# EAGLE design rc13-mbed-main-board (EAGLE 6.5.0)
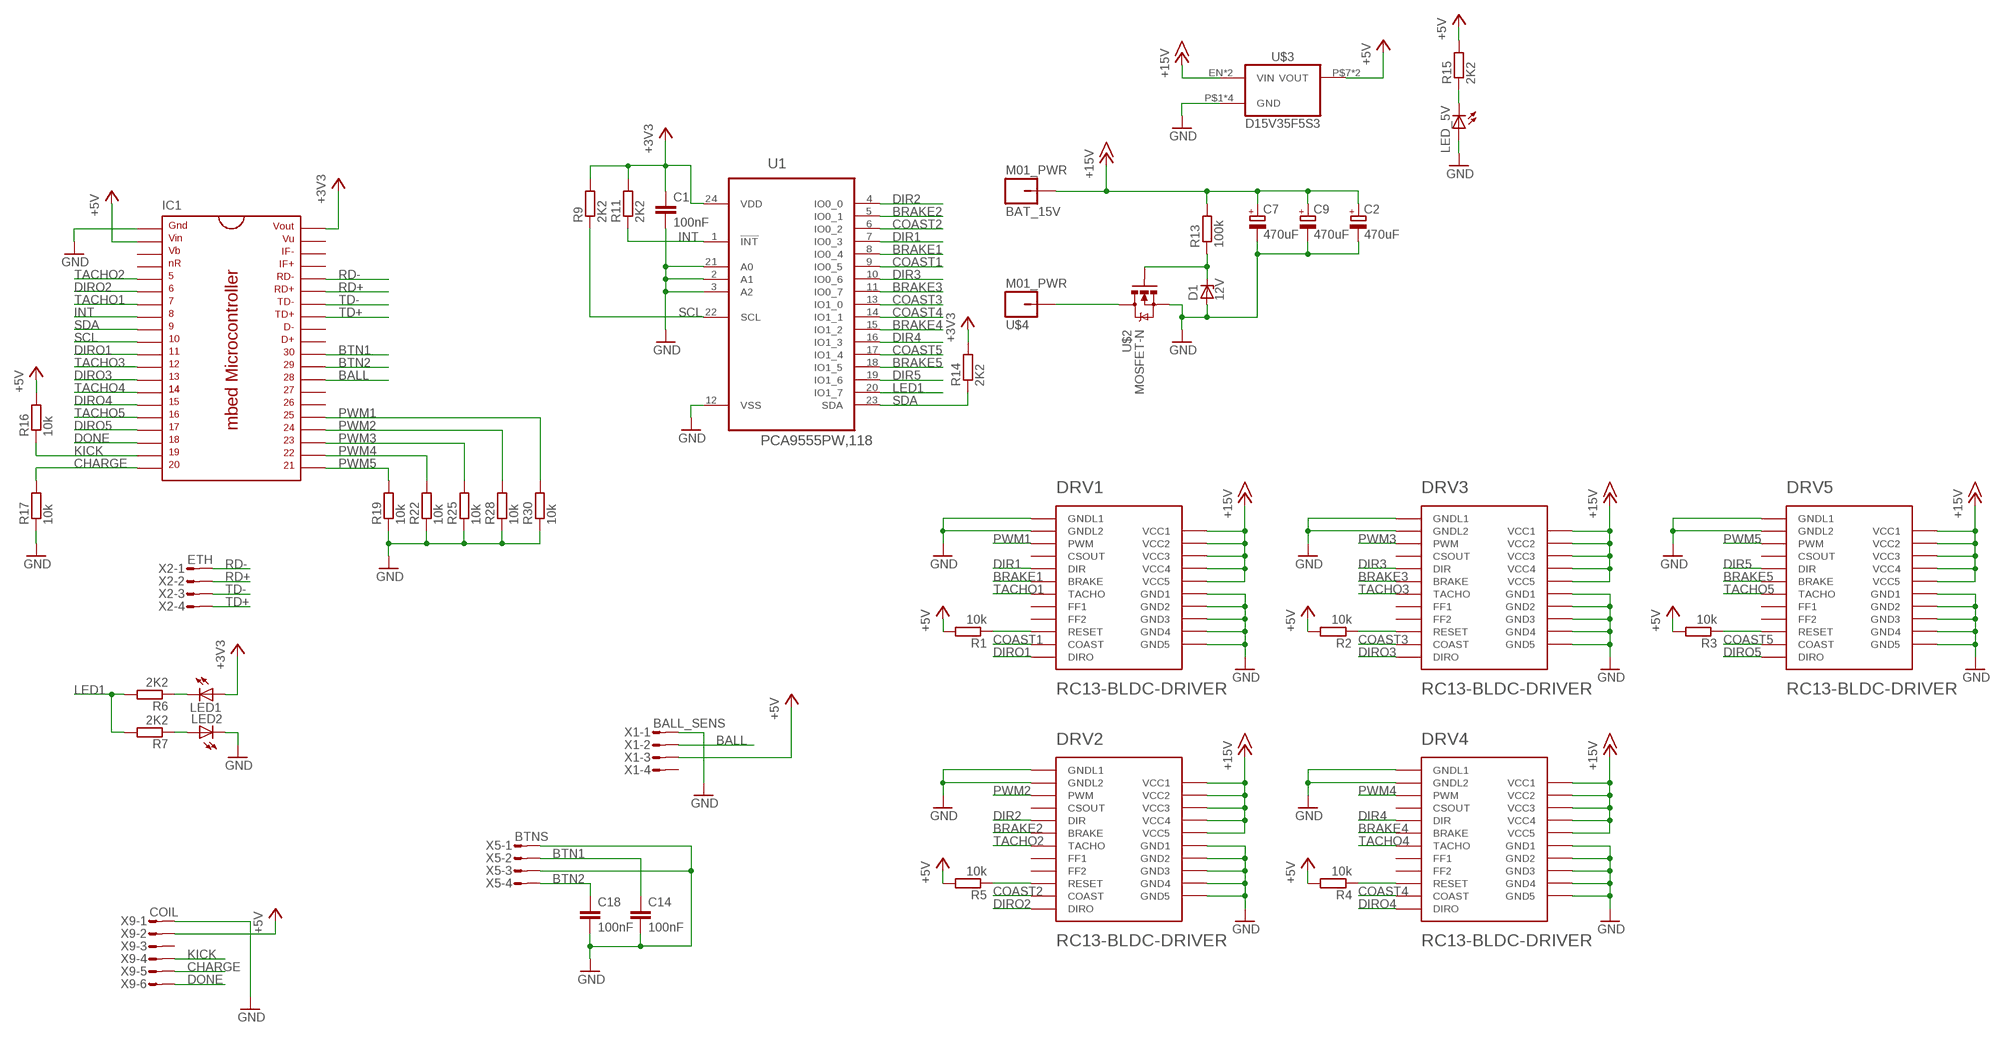
[diagram p0: schematic, sheet 1]

## Parts
BAT_15V  M01_PWR  [PWR_HOLE]
C1  100nF  C-EUC0603K  [C0603K]
C2  470uF  CPOL-EUE3.5-8  [E3,5-8]
C7  470uF  CPOL-EUE3.5-8  [E3,5-8]
C9  470uF  CPOL-EUE3.5-8  [E3,5-8]
C14  100nF  C-EUC0603K  [C0603K]
C18  100nF  C-EUC0603K  [C0603K]
D1  12V  ZENER-DIODESOD123  [SOD123]
DRV1  RC13-BLDC-DRIVER  [RC13-BLDC-DRIVER]
DRV2  RC13-BLDC-DRIVER  [RC13-BLDC-DRIVER]
DRV3  RC13-BLDC-DRIVER  [RC13-BLDC-DRIVER]
DRV4  RC13-BLDC-DRIVER  [RC13-BLDC-DRIVER]
DRV5  RC13-BLDC-DRIVER  [RC13-BLDC-DRIVER]
IC1  MBED_MICROCONTROLLER  [DIL40_0.9]
LED1  LEDCHIP-LED0603  [CHIP-LED0603]
LED2  LEDCHIP-LED0603  [CHIP-LED0603]
LED_5V  LEDCHIP-LED0603  [CHIP-LED0603]
R1  10k  R-EU_R0603  [R0603]
R2  10k  R-EU_R0603  [R0603]
R3  10k  R-EU_R0603  [R0603]
R4  10k  R-EU_R0603  [R0603]
R5  10k  R-EU_R0603  [R0603]
R6  2K2  R-EU_R0603  [R0603]
R7  2K2  R-EU_R0603  [R0603]
R9  2K2  R-EU_R0603  [R0603]
R11  2K2  R-EU_R0603  [R0603]
R13  100k  R-EU_R0603  [R0603]
R14  2K2  R-EU_R0603  [R0603]
R15  2K2  R-EU_R0603  [R0603]
R16  10k  R-EU_R0603  [R0603]
R17  10k  R-EU_R0603  [R0603]
R19  10k  R-EU_R0603  [R0603]
R22  10k  R-EU_R0603  [R0603]
R25  10k  R-EU_R0603  [R0603]
R28  10k  R-EU_R0603  [R0603]
R30  10k  R-EU_R0603  [R0603]
U1  PCA9555PW,118  [SOP65P640X110-24N]
U$2  MOSFET-N  MOSFET-N-SOT669  [TO127P600X120-5N]
U$3  D15V35F5S3  [D15V35F5S3]
U$4  M01_PWR  [PWR_HOLE]
X1  BALL_SENS  MICROMATCH-4  [MICROMATCH-4]
X2  ETH  MICROMATCH-4  [MICROMATCH-4]
X5  BTNS  MICROMATCH-4  [MICROMATCH-4]
X9  COIL  MICROMATCH-6  [MICROMATCH-6]

## Nets
+3V3: C1.1 IC1.40 LED1.A R9.2 R11.2 R14.2 U1.24(VDD)
+5V: IC1.2 R1.2 R2.2 R3.2 R4.2 R5.2 R15.2 R16.2 U$3.P$7(VOUT) U$3.P$8(VOUT) X1.3 X9.2
+15V: BAT_15V.P$1 C2.+ C7.+ C9.+ DRV1.PWR1(VCC1) DRV1.PWR2(VCC2) DRV1.PWR3(VCC3) DRV1.PWR4(VCC4) DRV1.PWR5(VCC5) DRV2.PWR1(VCC1) DRV2.PWR2(VCC2) DRV2.PWR3(VCC3) DRV2.PWR4(VCC4) DRV2.PWR5(VCC5) DRV3.PWR1(VCC1) DRV3.PWR2(VCC2) DRV3.PWR3(VCC3) DRV3.PWR4(VCC4) DRV3.PWR5(VCC5) DRV4.PWR1(VCC1) DRV4.PWR2(VCC2) DRV4.PWR3(VCC3) DRV4.PWR4(VCC4) DRV4.PWR5(VCC5) DRV5.PWR1(VCC1) DRV5.PWR2(VCC2) DRV5.PWR3(VCC3) DRV5.PWR4(VCC4) DRV5.PWR5(VCC5) R13.2 U$3.EN(VIN) U$3.P$5(VIN)
BALL: IC1.28 X1.2
BAT_GND: U$2.5(D) U$4.P$1
BRAKE1: DRV1.LOGIC6(BRAKE) U1.8(IO0_4)
BRAKE2: DRV2.LOGIC6(BRAKE) U1.5(IO0_1)
BRAKE3: DRV3.LOGIC6(BRAKE) U1.11(IO0_7)
BRAKE4: DRV4.LOGIC6(BRAKE) U1.15(IO1_2)
BRAKE5: DRV5.LOGIC6(BRAKE) U1.18(IO1_5)
BTN1: C14.1 IC1.30 X5.2
BTN2: C18.1 IC1.29 X5.4
CHARGE: IC1.20 R17.2 X9.5
COAST1: DRV1.LOGIC11(COAST) U1.9(IO0_5)
COAST2: DRV2.LOGIC11(COAST) U1.6(IO0_2)
COAST3: DRV3.LOGIC11(COAST) U1.13(IO1_0)
COAST4: DRV4.LOGIC11(COAST) U1.14(IO1_1)
COAST5: DRV5.LOGIC11(COAST) U1.17(IO1_4)
DIR1: DRV1.LOGIC5(DIR) U1.7(IO0_3)
DIR2: DRV2.LOGIC5(DIR) U1.4(IO0_0)
DIR3: DRV3.LOGIC5(DIR) U1.10(IO0_6)
DIR4: DRV4.LOGIC5(DIR) U1.16(IO1_3)
DIR5: DRV5.LOGIC5(DIR) U1.19(IO1_6)
DIRO1: DRV1.LOGIC12(DIRO) IC1.11
DIRO2: DRV2.LOGIC12(DIRO) IC1.6
DIRO3: DRV3.LOGIC12(DIRO) IC1.13
DIRO4: DRV4.LOGIC12(DIRO) IC1.15
DIRO5: DRV5.LOGIC12(DIRO) IC1.17
DONE: IC1.18 X9.6
GND: C1.2 C2.- C7.- C9.- C14.2 C18.2 D1.A DRV1.LOGIC1(GNDL1) DRV1.LOGIC2(GNDL2) DRV1.PWR6(GND1) DRV1.PWR7(GND2) DRV1.PWR8(GND3) DRV1.PWR9(GND4) DRV1.PWR10(GND5) DRV2.LOGIC1(GNDL1) DRV2.LOGIC2(GNDL2) DRV2.PWR6(GND1) DRV2.PWR7(GND2) DRV2.PWR8(GND3) DRV2.PWR9(GND4) DRV2.PWR10(GND5) DRV3.LOGIC1(GNDL1) DRV3.LOGIC2(GNDL2) DRV3.PWR6(GND1) DRV3.PWR7(GND2) DRV3.PWR8(GND3) DRV3.PWR9(GND4) DRV3.PWR10(GND5) DRV4.LOGIC1(GNDL1) DRV4.LOGIC2(GNDL2) DRV4.PWR6(GND1) DRV4.PWR7(GND2) DRV4.PWR8(GND3) DRV4.PWR9(GND4) DRV4.PWR10(GND5) DRV5.LOGIC1(GNDL1) DRV5.LOGIC2(GNDL2) DRV5.PWR6(GND1) DRV5.PWR7(GND2) DRV5.PWR8(GND3) DRV5.PWR9(GND4) DRV5.PWR10(GND5) IC1.1 LED2.C LED_5V.A R17.1 R19.1 R22.1 R25.1 R28.1 R30.1 U1.2(A1) U1.3(A2) U1.12(VSS) U1.21(A0) U$2.1(S) U$2.2(S) U$2.3(S) U$3.P$1(GND) U$3.P$2(GND) U$3.P$3(GND) U$3.P$4(GND) X1.1 X5.1 X5.3 X9.1
INT: IC1.8 R11.1 U1.1(!INT)
KICK: IC1.19 R16.1 X9.4
LED1: R6.2 R7.2 U1.20(IO1_7)
N$2: DRV1.LOGIC10(RESET) R1.1
N$3: DRV2.LOGIC10(RESET) R5.1
N$4: DRV4.LOGIC10(RESET) R4.1
N$5: DRV5.LOGIC10(RESET) R3.1
N$6: DRV3.LOGIC10(RESET) R2.1
N$7: LED1.C R6.1
N$8: LED2.A R7.1
N$9: LED_5V.C R15.1
N$20: D1.C R13.1 U$2.4(G)
PWM1: DRV1.LOGIC3(PWM) IC1.25 R30.2
PWM2: DRV2.LOGIC3(PWM) IC1.24 R28.2
PWM3: DRV3.LOGIC3(PWM) IC1.23 R25.2
PWM4: DRV4.LOGIC3(PWM) IC1.22 R22.2
PWM5: DRV5.LOGIC3(PWM) IC1.21 R19.2
RD+: IC1.35 X2.2
RD-: IC1.36 X2.1
SCL: IC1.10 R9.1 U1.22(SCL)
SDA: IC1.9 R14.1 U1.23(SDA)
TACHO1: DRV1.LOGIC7(TACHO) IC1.7
TACHO2: DRV2.LOGIC7(TACHO) IC1.5
TACHO3: DRV3.LOGIC7(TACHO) IC1.12
TACHO4: DRV4.LOGIC7(TACHO) IC1.14
TACHO5: DRV5.LOGIC7(TACHO) IC1.16
TD+: IC1.33 X2.4
TD-: IC1.34 X2.3
Unconnected: DRV1.LOGIC4(CSOUT) DRV1.LOGIC8(FF1) DRV1.LOGIC9(FF2) DRV2.LOGIC4(CSOUT) DRV2.LOGIC8(FF1) DRV2.LOGIC9(FF2) DRV3.LOGIC4(CSOUT) DRV3.LOGIC8(FF1) DRV3.LOGIC9(FF2) DRV4.LOGIC4(CSOUT) DRV4.LOGIC8(FF1) DRV4.LOGIC9(FF2) DRV5.LOGIC4(CSOUT) DRV5.LOGIC8(FF1) DRV5.LOGIC9(FF2) IC1.3 IC1.4 IC1.26 IC1.27 IC1.31 IC1.32 IC1.37 IC1.38 IC1.39 X1.4 X9.3

## Library data of the parts
BAT_15V U$4 = tellis2:M01_PWR
C1 C14 C18 = rcl:C-EU: CAPACITOR, European symbol
C2 C7 C9 = rcl:CPOL-EU: POLARIZED CAPACITOR, European symbol
D1 = diode:ZENER-DIODE: Z-Diode
DRV1-DRV5 = rc13-bldc-driver:RC13-BLDC-DRIVER
IC1 = mbed-microcontroller:MBED_MICROCONTROLLER: mbed Microcontroller, DIP40, 0.9"
LED1 LED2 LED_5V = led:LED: LED OSRAM: - CHIPLED LG R971, LG N971, LY N971, LG Q971, LY Q971, LO R971, LY R971 LH N974, LH R974 LS Q976, LO Q976, LY Q976 LO Q996 - Hyper CHIPLED LW Q18S LB Q993, LB Q99A, LB R99A - SideLED LS A670, LO A670, LY A670, LG A670, LP A670 LB A673, LV A673, LT A673, LW A673 LH A674 LY A675 LS A676, LA A676, LO A676, LY A676, LW A676 LS A679, LY A679, LG A679 - Hyper Micro SIDELED® LS Y876, LA Y876, LO Y876, LY Y876 LT Y87S - SmartLED LW L88C, LW L88S LB L89C, LB L89S, LG L890 LS L89K, LO L89K, LY L89K LS L896, LA L896, LO L896, LY L896 - TOPLED LS T670, LO T670, LY T670, LG T670, LP T670 LSG T670, LSP T670, LSY T670, LOP T670, LYG T670 LG T671, LOG T671, LSG T671 LB T673, LV T673, LT T673, LW T673 LH T674 LS T676, LA T676, LO T676, LY T676, LB T676, LH T676, LSB T676, LW T676 LB T67C, LV T67C, LT T67C, LS T67K, LO T67K, LY T67K, LW E67C LS E67B, LA E67B, LO E67B, LY E67B, LB E67C, LV E67C, LT E67C LW T67C LS T679, LY T679, LG T679 LS T770, LO T770, LY T770, LG T770, LP T770 LB T773, LV T773, LT T773, LW T773 LH T774 LS E675, LA E675, LY E675, LS T675 LS T776, LA T776, LO T776, LY T776, LB T776 LHGB T686 LT T68C, LB T68C - Hyper Mini TOPLED® LB M676 - Mini TOPLED Santana® LG M470 LS M47K, LO M47K, LY M47K Source: http://www.osram.convergy.de LUXEON: - LUMILED® LXK2-PW12-R00, LXK2-PW12-S00, LXK2-PW14-U00, LXK2-PW14-V00 LXK2-PM12-R00, LXK2-PM12-S00, LXK2-PM14-U00 LXK2-PE12-Q00, LXK2-PE12-R00, LXK2-PE12-S00, LXK2-PE14-T00, LXK2-PE14-U00 LXK2-PB12-K00, LXK2-PB12-L00, LXK2-PB12-M00, LXK2-PB14-N00, LXK2-PB14-P00, LXK2-PB14-Q00 LXK2-PR12-L00, LXK2-PR12-M00, LXK2-PR14-Q00, LXK2-PR14-R00 LXK2-PD12-Q00, LXK2-PD12-R00, LXK2-PD12-S00 LXK2-PH12-R00, LXK2-PH12-S00 LXK2-PL12-P00, LXK2-PL12-Q00, LXK2-PL12-R00 Source: www.luxeon.com KINGBRIGHT: KA-3528ASYC Source: www.kingbright.com
R1-R7 R9 R11 R13-R17 R19 R22 R25 R28 R30 = rcl:R-EU_: RESISTOR, European symbol
U1 = PCA9555:PCA9555PW,118: IC, I/O EXPANDER, 16BIT, 24TSSOP; MPN: PCA9555PW,118; OC_FARNELL: 2101299; OC_NEWARK: 70R6680; PACKAGE: 24TSSOP; SUPPLIER: NXP
U$2 = nxp_sot669:MOSFET-N-SOT669
U$3 = D15V35F5S3:D15V35F5S3
X1 X2 X5 = con-amp-micromatch:MICROMATCH-4: MicroMaTch 4 7-215464-4 / 0-215464-4 Drawing Number C-215464 DDEController.pdf; MPN: 7-215464-4; OC_FARNELL: 3784629; OC_NEWARK: 19R8124
X9 = con-amp-micromatch:MICROMATCH-6: MicroMaTch 6 7-215464-6 / 0-215464-6 Drawing Number C-215464 DDEController.pdf; MPN: 7-215464-6; OC_FARNELL: 3784630; OC_NEWARK: 19R8125

## Board
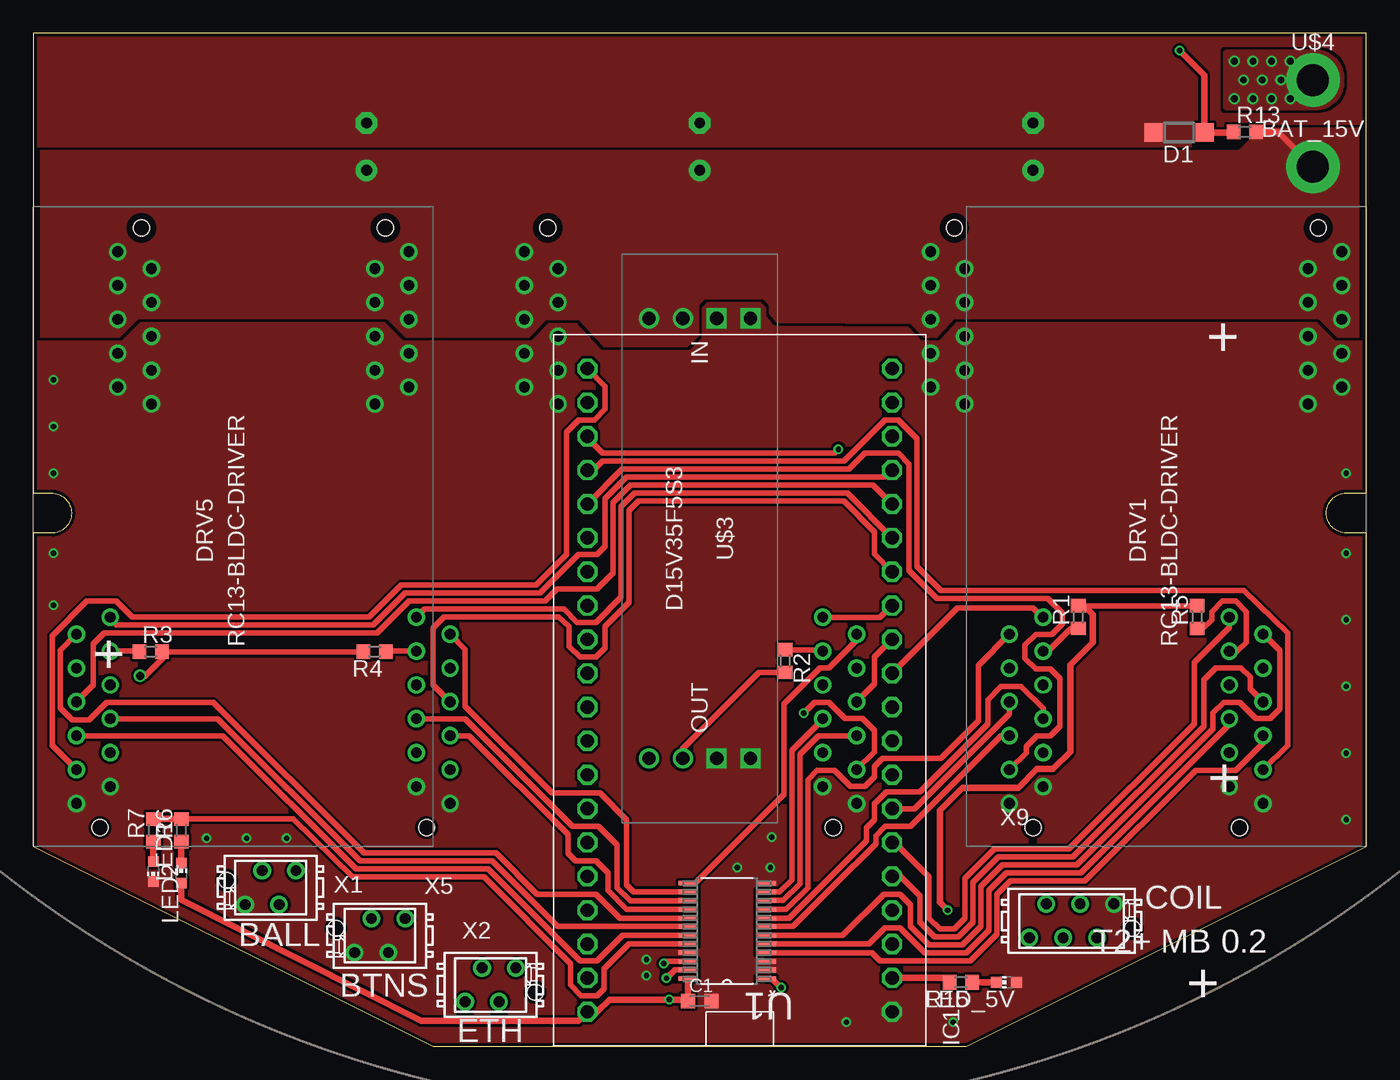
[diagram p1: board, top side]
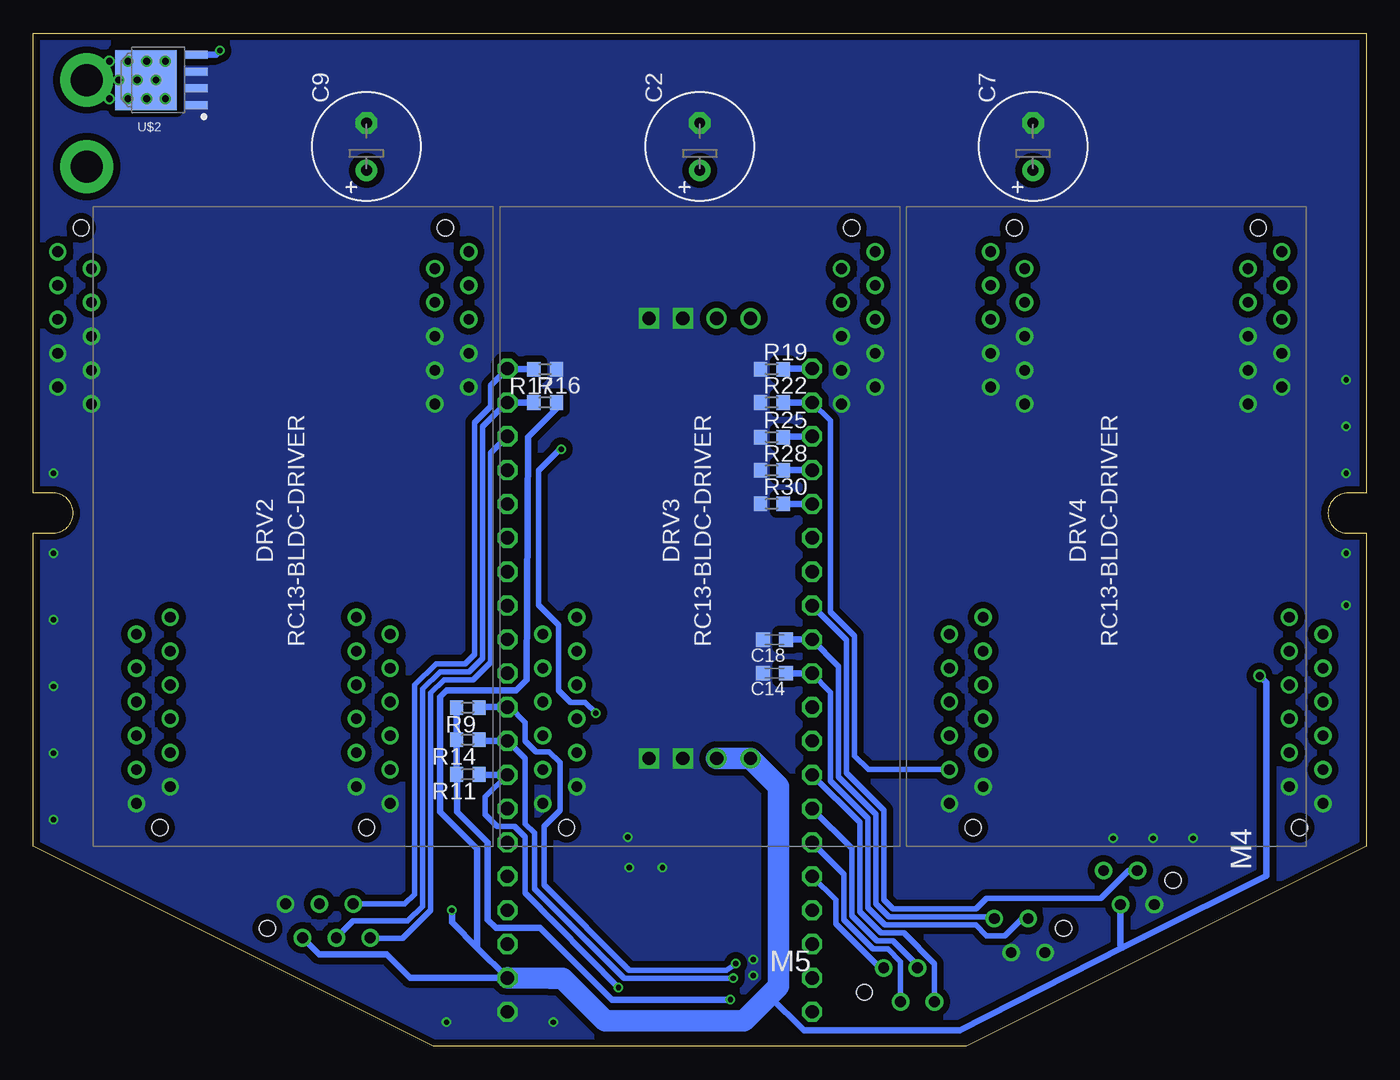
[diagram p2: board, bottom side, seen from below]

Size 100 x 76 mm. Coordinates in mm from the lower left corner, seen from the top.
Outline: 0,15 30,0 70,0 100,15 100,38.5 98.5,38.5 arc-180 98.5,41.5 100,41.5 100,76 0,76 0,41.5 1.5,41.5 arc-169 1.5,38.5 0,38.5 0,15
Copper layers (1*16): Top 0.035mm / dielectric 1.5mm / Bottom 0.035mm
Design rules "Fusion_eagle_rule_v1.1 *": minimum track width 6mil, minimum drill 12mil, track to track 0.2mm, track to pad 0.2mm, pad to pad 0.2mm, via to via 0.2mm, smd to smd 0mil, copper to edge 10mil, drill to drill 10mil, minimum pad ring 10mil, minimum via ring 6mil, stop-mask expansion 2mil, vias tented up to drill 100mil, thermal gap 10mil
Holes 1.2 mm at 82.45,8.85 37.65,4.05 22.7,8.85 14.5,12.45

### Footprints (pad centres in the part's own frame; a part is rotated, then mirrored left to right if it is on the bottom)
PWR_HOLE = drill 2.4 pad 4: P$1 0,0
C0603K = smd 1.05 x 1.08: 1 -0.875,0; 2 0.875,0
E3,5-8 = drill 0.813 pad 1.6: + -1.778,0 | drill 0.813 pad 1.6 octagon: - 1.778,0
SOD123 = smd 1.4 x 1.4: A 1.9,0; C -1.9,0
RC13-BLDC-DRIVER = drill 0.8 pad 1.3: LOGIC1 3.215,26.77; LOGIC2 4.485,24.23; LOGIC3 5.755,26.77; LOGIC4 7.025,24.23; LOGIC5 8.295,26.77; LOGIC6 9.565,24.23; LOGIC7 10.835,26.77; LOGIC8 12.105,24.23; LOGIC9 13.375,26.77; LOGIC10 14.645,24.23; LOGIC11 15.915,26.77; LOGIC12 17.185,24.23; PWR1 44.615,1.83; PWR2 43.345,4.37; PWR3 42.075,1.83; PWR4 40.805,4.37; PWR5 39.535,1.83; PWR6 38.265,4.37; PWR7 36.995,1.83; PWR8 35.725,4.37; PWR9 34.455,1.83; PWR10 33.185,4.37 | hole 1.2: 1.4,25; 46.4,3.6
DIL40_0.9 = drill 1 pad 1.397 octagon: 1 -22.86,-11.43; 2 -20.32,-11.43; 3 -17.78,-11.43; 4 -15.24,-11.43; 5 -12.7,-11.43; 6 -10.16,-11.43; 7 -7.62,-11.43; 8 -5.08,-11.43; 9 -2.54,-11.43; 10 0,-11.43; 11 2.54,-11.43; 12 5.08,-11.43; 13 7.62,-11.43; 14 10.16,-11.43; 15 12.7,-11.43; 16 15.24,-11.43; 17 17.78,-11.43; 18 20.32,-11.43; 19 22.86,-11.43; 20 25.4,-11.43; 21 25.4,11.43; 22 22.86,11.43; 23 20.32,11.43; 24 17.78,11.43; 25 15.24,11.43; 26 12.7,11.43; 27 10.16,11.43; 28 7.62,11.43; 29 5.08,11.43; 30 2.54,11.43; 31 0,11.43; 32 -2.54,11.43; 33 -5.08,11.43; 34 -7.62,11.43; 35 -10.16,11.43; 36 -12.7,11.43; 37 -15.24,11.43; 38 -17.78,11.43; 39 -20.32,11.43; 40 -22.86,11.43
CHIP-LED0603 = smd 0.8 x 0.8: A 0,-0.75; C 0,0.75
R0603 = smd 1 x 1.1: 1 -0.85,0; 2 0.85,0
SOP65P640X110-24N = smd 1.473 x 0.356: 1 -2.921,3.581; 2 -2.921,2.921; 3 -2.921,2.286; 4 -2.921,1.626; 5 -2.921,0.965; 6 -2.921,0.33; 7 -2.921,-0.33; 8 -2.921,-0.965; 9 -2.921,-1.626; 10 -2.921,-2.286; 11 -2.921,-2.921; 12 -2.921,-3.581; 13 2.921,-3.581; 14 2.921,-2.921; 15 2.921,-2.286; 16 2.921,-1.626; 17 2.921,-0.965; 18 2.921,-0.33; 19 2.921,0.33; 20 2.921,0.965; 21 2.921,1.626; 22 2.921,2.286; 23 2.921,2.921; 24 2.921,3.581
TO127P600X120-5N = smd 1.65 x 0.6: 1 -2.65,1.905; 2 -2.65,0.635; 3 -2.65,-0.635; 4 -2.65,-1.905 | smd 4.6 x 4.5: 5 1.15,0
D15V35F5S3 = drill 1: EN -16.51,-3.81; P$5 -16.51,-1.27; P$7 16.51,-1.27; P$8 16.51,-3.81 | drill 1 square: P$1 -16.51,3.81; P$2 -16.51,1.27; P$3 16.51,3.81; P$4 16.51,1.27
MICROMATCH-4 = drill 0.813: 1 1.905,1.27; 2 0.635,-1.27; 3 -0.635,1.27; 4 -1.905,-1.27
MICROMATCH-6 = drill 0.813: 1 3.175,1.27; 2 1.905,-1.27; 3 0.635,1.27; 4 -0.635,-1.27; 5 -1.905,1.27; 6 -3.175,-1.27

### Placement (x,y rotation side)
BAT_15V  96,66 0 top
C1  50,3.4 0 top
C2  50,67.5 90 bottom
C7  25,67.5 90 bottom
C9  75,67.5 90 bottom
C14  44.4,28 180 bottom
C18  44.4,30.5 180 bottom
D1  85.95,68.56 180 top
DRV1  100,15 90 top
DRV2  65.5,15 90 bottom
DRV3  35,15 90 bottom
DRV4  4.5,15 90 bottom
DRV5  30,15 90 top
IC1  53,25.44 90 top
LED1  11.1,13 0 top
LED2  9,13.1 180 top
LED_5V  73,4.8 90 top
R1  78.4,32.2 90 top
R2  56.4,28.9 270 top
R3  8.8,29.6 0 top
R4  25.6,29.6 180 top
R5  87.3,32.2 90 top
R6  11.1,16.2 90 top
R7  9,16.2 90 top
R9  67.4,25.4 180 bottom
R11  67.4,20.4 180 bottom
R13  90.89,68.59 0 top
R14  67.4,23 180 bottom
R15  69.6,4.8 180 top
R16  61.6,48.3 0 bottom
R17  61.6,50.8 180 bottom
R19  44.6,50.8 0 bottom
R22  44.6,48.3 0 bottom
R25  44.6,45.7 0 bottom
R28  44.6,43.2 0 bottom
R30  44.6,40.7 0 bottom
U1  52.05,8.65 180 top
U$2  90.4,72.5 180 bottom
U$3  50,38.1 270 top
U$4  96,72.5 0 top
X1  17.8,11.9 180 top
X2  34.3,4.6 0 top
X5  26,8.3 180 top
X9  77.9,9.4 0 top

### Tracks (layer width: path | path; a pad name or v marks a point on that pad's centre or on a via)
+3V3  (via drill 0.4)
  Top 0.4: C1.1 | 11.1,11.7 LED1.A
  Top 0.5: C1.1 U1.24 | C1.1 49.02,3.5 v47.7,3.5 43.22,3.5 42.3,2.58 IC1.40 41.54,2.54 40.9,1.9 29.1,1.9 11.1,11 11.1,11.7
  Bottom 0.5: R9.2 R14.2 R11.2 68.2,20.35 68.2,17.6 65.9,15.3 65.9,9.5 65.3,8.9 62,8.9 56.6,3.5 v47.7,3.5
+5V  (via drill 0.4, 0.6)
  Top 0.4: R1.2 R5.2 | R2.2 54.45,28.05 48.7,22.3 48.7,21.62 U$3.P$7
  Top 0.406: R3.2 R4.2
  Top 0.5: R15.2 68.23,5.12 IC1.2 | 24.7,29.45 R4.2 | v8,27.8 8.4,27.8 9.7,29.1 9.7,29.55 R3.2 | R1.2 78.85,33.05 79.5,32.4 79.5,30.3 77.8,28.6 77.8,22.1 76.5,20.8 75.3,20.8 73.9,19.4 69.7,19.4 68,17.7 68,10.8 v68.6,10.2
  Bottom 0.5: 61.2,5.2 IC1.2 | R16.2 60.75,47.85 62.9,45.7 63,27.5 63.8,26.7 69,26.7 69.5,26.2 69.5,17.6 66.7,14.8 66.7,7.4 | IC1.2 66.7,7.4 | 18.25,7.41 16.7,8.2 7.5,12.8 7.5,27.3 v8,27.8 | 18.25,7.41 30.5,1.2 42.2,1.2 44.8,3.8 | v68.6,10.2 68.6,9.3 66.7,7.4 | X9.2 78.58,6.9 73.5,6.9 71.72,5.12 IC1.2 | X1.3 18.43,7.59 18.25,7.41
  Bottom 1.6: U$3.P$7 U$3.P$8 44.09,19.49 44.09,4.51 44.8,3.8 46.7,1.9 57.1,1.9 60.3,5.1 61.18,5.1 IC1.2
+15V
  Top 0.5: R13.2 93.41,68.59 BAT_15V.P$1
  pour Top (isolate 0.5, no thermals): 0,53.4 6.4,53.4 7.8,54.8 26.6,54.8 28,53.4 37.1,53.4 38.4,54.7 41,54.7 42.9,52.7 49,52.7 49.7,53.4 49.7,55.7 50.3,56.3 54.8,56.3 55.4,55.7 55.4,55.1 55.9,54.5 65.9,54.4 66.9,53.4 67.7,53.4 69,54.8 96.5,54.8 97.9,53.4 100,53.4 100,68.7 92.2,68.7 90.5,67 0,67
BALL
  Bottom 0.4: IC1.28 39,30.49 39,20.5 36.2,17.7 36.2,11 35.5,10.3 29.3,10.3 28.5,11.1 19.9,11.1 17.8,13.2 17.2,13.2 X1.2
BAT_GND  (via drill 0.5)
  Bottom 0.4: v92.2,72.5 U$2.5
  other vias: 90.1,73.9 90.8,72.5 90.1,71.1 91.5,73.9 91.5,71.1 92.9,73.9 93.6,72.5 92.9,71.1 94.3,73.9 94.3,71.1
  pour Top (isolate 0.5, no thermals): 89.5,74.55 89.5,70.45 96.15,70.45 arc90 98.15,72.45 98.15,72.55 arc90 96.15,74.55
BRAKE1
  Top 0.4: DRV1.LOGIC6 75.77,25.33 74.1,27 72.6,27 71.6,26 71.6,24.2 | U1.8 54.99,9.6 56.7,9.6 59.4,12.3
  Top 0.406: 59.4,12.3 62.5,15.4 62.5,16.4 63.1,17 63.1,18.2 64,19.1 66.5,19.1 71.6,24.2
BRAKE2
  Top 0.4: U1.5 62.69,7.68 63.9,8.9 65,8.9 66.9,7 70,7 71.7,8.7 71.7,11.7 73,13 78.6,13 89.7,24.1 89.7,24.54 DRV2.LOGIC6
BRAKE3
  Top 0.4: U1.11 55.97,11.57 56.9,12.5 56.9,22.2 59.23,24.53 DRV3.LOGIC6
BRAKE4
  Top 0.4: 49.09,10.9 U1.15
  Top 0.406: 49.09,10.9 44.8,10.9 43.8,11.9 43.8,15.1 42.4,16.5 40.47,16.5 32.4,24.57 DRV4.LOGIC6
BRAKE5
  Top 0.4: 39.32,8.98 34.4,13.9 24.5,13.9 13.84,24.57 DRV5.LOGIC6
  Top 0.406: U1.18 39.32,8.98
BTN1
  Bottom 0.4: IC1.30 40.2,26.54 40.2,19.9 37.4,17.1 37.4,10.4 36.1,9.1 29.3,9.1 28.5,8.3 27.1,8.3 25.83,9.57 X5.2
  Bottom 0.5: IC1.30 43.1,27.98 C14.1
BTN2
  Bottom 0.4: IC1.29 39.6,28.48 39.6,20.2 36.8,17.4 36.8,10.7 35.8,9.7 28.04,9.7 X5.4
  Bottom 0.5: IC1.29 43.41,30.52 C18.1
CHARGE
  Bottom 0.4: IC1.20 65.7,49.57 65.7,48 66.9,46.8 66.9,29.4 67.6,28.7 69.8,28.7 71.4,27.1 71.4,11.4 72.13,10.67 X9.5
  Bottom 0.5: IC1.20 64.06,50.8 R17.2
COAST1
  Top 0.4: U1.9 56.48,10.28 58.1,11.9 58.1,20 58.8,20.7 60.1,20.7 61.3,19.5 62.4,19.5 | 70.9,24.4 70.9,28.59 DRV1.LOGIC11
  Top 0.406: 62.4,19.5 63.1,20.2 63.1,21 63.7,21.6 68.1,21.6 70.9,24.4
COAST2
  Top 0.4: DRV2.LOGIC11 93.5,29.68 93.5,25.3 92.8,24.6 91.7,24.6 90.5,25.8 89.3,25.8 88.5,25 88.5,23.8 78.3,13.6 72.7,13.6 71.1,12 71.1,9 69.7,7.6 67.2,7.6 65.8,9 65.8,10.6 65,11.4 63.8,11.4 60.72,8.32 U1.6
COAST3
  Top 0.4: U1.13 49.63,12.23 56.3,18.9 56.3,25.7 59,28.4 59.7,28.4 61.81,30.52 DRV3.LOGIC11
COAST4
  Top 0.4: DRV4.LOGIC11 32.4,29.79 32.4,25.5
  Top 0.406: U1.14 45.03,11.57 44.5,12.1 44.5,17 42.5,19 38.9,19 32.4,25.5
COAST5
  Top 0.4: DRV5.LOGIC11 2,29.68 2,25.4 2.9,24.5 4.2,24.5 5.5,25.8 13.5,25.8 24.8,14.5 34.7,14.5 37.8,11.4
  Top 0.406: 37.8,11.4 42.2,11.4 44,9.6 49.11,9.6 U1.17
DIR1
  Top 0.4: U1.7 54.99,9 57,9 60,12
  Top 0.406: 60,12 63.2,15.2 63.2,15.8 63.9,16.5 65.8,16.5 72.59,23.3 DRV1.LOGIC5
DIR2
  Top 0.4: DRV2.LOGIC5 92.27,22.77 90.2,20.7 87.2,20.7 78.9,12.4 73.3,12.4 72.3,11.4 72.3,8.4 70.3,6.4 63.5,6.4 62.9,7 54.99,7 U1.4
DIR3
  Top 0.4: U1.10 56.24,10.94 57.5,12.2 57.5,21.9 58.9,23.3 DRV3.LOGIC5
DIR4
  Top 0.406: U1.16 44.52,10.28 43.1,11.7 43.1,13 42.2,13.9 40.66,13.9 40.1,14.46 40.1,15.9 32.7,23.3 DRV4.LOGIC5
DIR5
  Top 0.4: 46.22,8.32 U1.19 | DRV5.LOGIC5 14.21,23.3 24.2,13.3 34.1,13.3 41,6.4
  Top 0.406: 46.22,8.32 44.22,8.32 42.3,6.4 41,6.4
DIRO1
  Top 0.4: IC1.11 69.32,32.9 75,32.9 75.72,32.19 DRV1.LOGIC12
DIRO2
  Top 0.4: IC1.6 64.62,15.28 67.2,12.7 67.2,9.6 68,8.8 69.1,8.8 69.9,9.6 69.9,12.6 72.1,14.8 77.7,14.8 87.1,24.2 87.1,28.8 89.73,31.43 DRV2.LOGIC12
DIRO3
  Top 0.4: DRV3.LOGIC12 63.52,32.19 IC1.13
DIRO4
  Top 0.4: DRV4.LOGIC12 29.34,32.8 39.8,32.8 40.8,31.8 42.2,31.8 44.1,33.7 44.1,40.5 45.1,41.5 61.07,41.5 IC1.15
DIRO5
  Top 0.4: DRV5.LOGIC12 5.77,32.03 6.2,31.6 25.5,31.6 27.9,34 38,34 40.9,36.9 42.3,36.9 42.9,37.5 42.9,41.1 44.5,42.7 63.91,42.7 IC1.17
DONE
  Bottom 0.4: IC1.18 65.7,44.5 65.7,28.8 67,27.5 69.2,27.5 70.2,26.5 70.2,10.2 72.3,8.1 74.69,8.1 X9.6
GND  (via drill 0.4)
  other vias: 1.5,50 1.5,43 1.5,37 98.5,37 98.5,43 98.5,32 98.5,27 98.5,22 98.5,17 13,15.6 16,15.6 19,15.6 1.5,46.5 1.5,33.1 52.8,13.4 55.3,13.4 55.4,15.7 61,1.8 69,1.8 46,5.3 46,6.5
  pour Top (isolate 0.2, rank 2, no thermals): 0,76 0,15 30,0 70,0 100,15 100,76
  pour Bottom (isolate 0.5, no thermals): 0,76 100,76 100,15 70,0 30,0 0,15
INT  (via drill 0.4)
  Top 0.4: U1.1 55.43,5.07 v56.1,4.4
  Bottom 0.4: v56.1,4.4 63.1,11.5 63.1,15.7 63.9,16.5 65.2,16.5 66.1,17.4 66.1,18.69 IC1.8
  Bottom 0.5: R11.1 66.51,20.36 IC1.8
KICK
  Bottom 0.4: X9.4 76,9.4 71.9,9.4 70.8,10.5 70.8,26.8 69.5,28.1 67.3,28.1 66.3,29.1 66.3,46.5 64.5,48.3 IC1.19
  Bottom 0.5: IC1.19 R16.1
LED1
  Top 0.4: U1.20 46.88,7.68 | R6.2 19.5,17.05 23.95,12.7 33.8,12.7 40.3,6.2
  Top 0.406: 46.88,7.68 44.69,7.68 42.8,5.8 42.8,4.3 42.3,3.8 41.1,3.8 40.3,4.6 40.3,6.2
  Top 0.5: R6.2 R7.2
N$2
  Top 0.4: DRV1.LOGIC10 76.14,29.64 77.8,31.3 78.05,31.3 R1.1
N$3
  Top 0.4: DRV2.LOGIC10 90.34,29.64 91,30.3 91,32.6 90.2,33.4 89.2,33.4
  Top 0.406: 89.2,33.4 88.4,32.6 88.4,32 87.75,31.35 R5.1
N$4
  Top 0.406: DRV4.LOGIC10 26.7,29.64 R4.1
N$5
  Top 0.406: DRV5.LOGIC10 8,29.64 R3.1
N$6
  Top 0.4: DRV3.LOGIC10 59.12,29.75 R2.1
N$7
  Top 0.5: LED1.C R6.1
N$8
  Top 0.5: R7.1 LED2.A
N$9
  Top 0.5: LED_5V.C R15.1
N$20  (via drill 0.4)
  Top 0.5: R13.1 89.77,68.56 D1.C 87.85,72.85 v86,74.7
  Bottom 0.5: U$2.4 86.3,74.41 v86,74.7
PWM1
  Top 0.4: DRV1.LOGIC3 74.5,22.02 74.5,22.5 75.3,23.3 76.3,23.3 77,24 77,27.6 76.3,28.3 75.2,28.3 74.4,29.1 74.4,30.1 75.2,30.9 76.4,30.9 77.2,31.7 77.2,32.5 76.1,33.6 67.8,33.6 65.7,35.7 65.7,43.7 64.9,44.5 62.4,44.5 61.2,43.3 44.16,43.3 IC1.25
  Bottom 0.5: R30.2 43.83,40.68 IC1.25
PWM2
  Top 0.4: DRV2.LOGIC3 94.1,22.59 94.1,31 90.8,34.2 68.1,34.2 66.3,36 66.3,45.6 64.9,47 63.9,47 60.8,43.9 42.7,43.9 42.02,43.22 IC1.24
  Bottom 0.5: R28.2 43.73,43.22 IC1.24
PWM3  (via drill 0.4)
  Top 0.4: IC1.23 41.6,45.6 42.7,44.5 60.1,44.5 v60.4,44.8 | DRV3.LOGIC3 63.1,22.09 63.1,23.7 62.2,24.6 60.9,24.6 59.7,25.8 58.6,25.8 v57.8,25
  Bottom 0.4: v57.8,25 58.6,25.8 59.7,25.8 60.6,26.7 60.6,31.6 62.1,33.1 62.1,43.2 60.5,44.8 v60.4,44.8
  Bottom 0.5: R25.2 43.59,45.76 IC1.23
PWM4
  Bottom 0.4: DRV4.LOGIC3 37.35,20.75 38.4,21.8 38.4,30.8 40.2,32.6 40.2,46.93 IC1.22
  Bottom 0.5: R22.2 IC1.22
PWM5
  Top 0.4: DRV5.LOGIC3 1.4,22.59 1.4,30.8 4,33.4 6.2,33.4 7.4,32.2 25.2,32.2 27.6,34.6 37.7,34.6 40,36.9 40,46.1 40.9,47 42.1,47 42.9,47.8 42.9,49.51 IC1.21
  Bottom 0.5: R19.2 43.31,50.84 IC1.21
RD+
  Bottom 0.4: X2.2 34.94,6.33 35.9,7.3 37,7.3 39.2,9.5 39.2,12.91 IC1.35
RD-
  Bottom 0.4: X2.1 36.57,5.97 39.8,9.2 39.8,10.97 IC1.36
SCL  (via drill 0.4)
  Top 0.4: U1.22 47.44,6.36 v47.3,6.2
  Bottom 0.4: IC1.10 64.24,25.44 63.1,24.3 63.1,22.9 62.3,22.1 61.3,22.1 60.5,21.3 60.5,17.7 61.7,16.5 61.7,12.1 55.3,5.7 48,5.7 v47.3,6.2
  Bottom 0.5: R9.1 66.51,25.44 IC1.10
SDA  (via drill 0.4)
  Top 0.4: U1.23 48.13,5.73 v47.5,5.1
  Bottom 0.4: v47.5,5.1 55.7,5.1 62.4,11.8 62.4,16 63.1,16.7 63.1,21.6 64.4,22.9 IC1.9
  Bottom 0.5: R14.1 66.45,22.9 IC1.9
TACHO1
  Top 0.4: DRV1.LOGIC7 73.23,24.93
  Top 0.406: 73.23,24.93 66.12,17.82 IC1.7
TACHO2
  Top 0.4: DRV2.LOGIC7 91.3,26.8 91.3,27.7 90.6,28.4 88.7,28.4 87.8,27.5 87.8,24 78,14.2 72.4,14.2 70.5,12.3 70.5,9.3 69.4,8.2 67.6,8.2 66.5,9.3 66.5,11.3 65.06,12.74 IC1.5
TACHO3
  Top 0.4: DRV3.LOGIC7 63.1,27.16 63.1,29.2 IC1.12
TACHO4
  Top 0.4: DRV4.LOGIC7 30,27.11 30,31.4 30.8,32.2 39.4,32.2 40.2,31.5 40.2,30 41,29.2 42.2,29.2 42.9,29.9 42.9,31.5 44.7,33.3 44.7,40.2 45.4,40.9 60.8,40.9 63.1,38.6 63.1,36.93 IC1.14
TACHO5
  Top 0.4: DRV5.LOGIC7 4.5,27.11 4.5,30.2 5.3,31 25.8,31 28.2,33.4 38.4,33.4 39.3,34.3 42.3,34.3 43.5,35.5 43.5,40.8 44.8,42.1 63.01,42.1 IC1.16
TD+
  Bottom 0.4: X2.4 32.4,6.2 34.7,8.5 36.4,8.5 38,10.1 38,16.8 IC1.33
TD-
  Bottom 0.4: X2.3 33.66,6.07 35.5,7.9 36.7,7.9 38.6,9.8 38.6,14.85 IC1.34

### Text on the board
tNames: + | + | + | COIL | BALL | T2+ MB 0.2 | BTNS | + | ETH
bNames: M4 | M5